# EAGLE schematic radical-pneu (EAGLE 7.2.0)
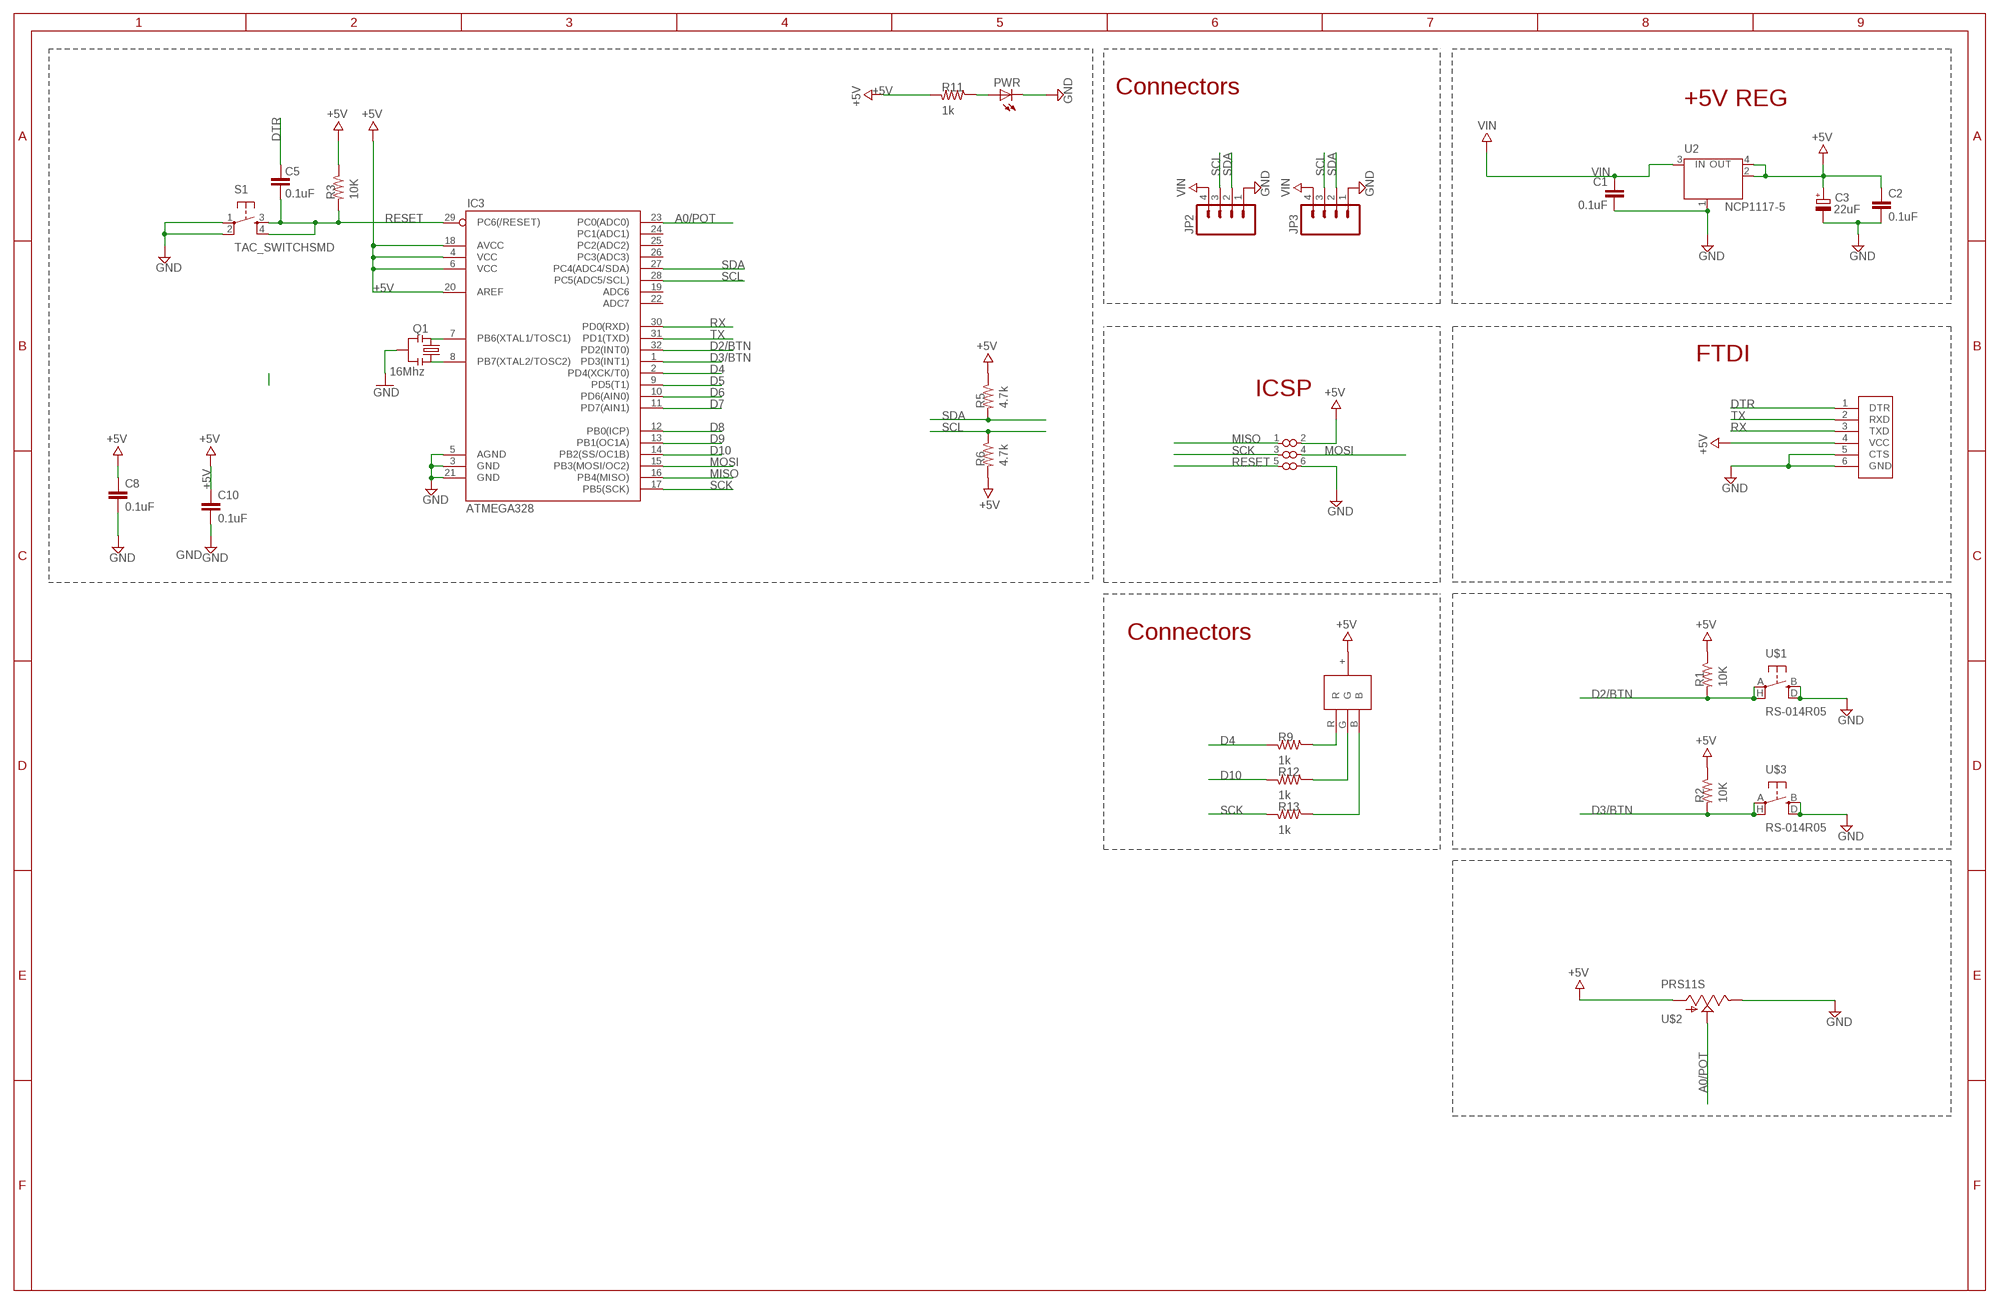
[diagram p0: schematic, sheet 1]

## Parts
C1  0.1uF  CAP0603-CAP  [0603-CAP]
C2  0.1uF  CAP0603-CAP  [0603-CAP]
C3  22uF  CPOL-EUSMCB  [SMC_B]
C5  0.1uF  CAP0805  [0805]
C8  0.1uF  CAP0603-CAP  [0603-CAP]
C10  0.1uF  CAP0603-CAP  [0603-CAP]
IC3  ATMEGA328  ATMEGA168  [TQFP32-08]
JP2  M04PTH  [1X04]
JP3  M04PTH  [1X04]
PWR  LEDCHIPLED_0603  [CHIPLED_0603]
Q1  16Mhz  RESONATORSMD  [RESONATOR-SMD]
R1  10K  RESISTOR0805-RES  [0805]
R2  10K  RESISTOR0805-RES  [0805]
R3  10K  RESISTOR0805-RES  [0805]
R5  4.7k  RESISTOR0805-RES  [0805]
R6  4.7k  RESISTOR0805-RES  [0805]
R9  1k  RESISTOR0805-RES  [0805]
R11  1k  RESISTOR0805-RES  [0805]
R12  1k  RESISTOR0805-RES  [0805]
R13  1k  RESISTOR0805-RES  [0805]
S1  TAC_SWITCHSMD  [TACTILE-SWITCH-SMD]
U2  NCP1117-5  LINEAR_MC33269ST  [LINEAR_SOT223]
U$1  RS-014R05  [SWITCH-11MM]
U$2  PRS11S  [PRS11S]
U$3  RS-014R05  [SWITCH-11MM]
U$10  ISP_POGO  [POGO_ISP]
U$12  FTDI_POGO  [FTDI_POGO]
U$21  LTST-C19FD1WT  [LTST]

## Nets
+5V: C2.1 C3.+ C8.1 C10.1 IC3.4(VCC) IC3.6(VCC) IC3.18(AVCC) IC3.20(AREF) R1.1 R2.1 R3.1 R5.1 R6.2 R11.2 U2.2(OUT) U2.4(OUT) U$2.1(A) U$10.2(VCC) U$12.4(VCC) U$21.+(VCC)
A0/POT: IC3.23(PC0(ADC0)) U$2.2(S)
D2/BTN: IC3.32(PD2(INT0)) R1.2 U$1.A U$1.H
D3/BTN: IC3.1(PD3(INT1)) R2.2 U$3.A U$3.H
D4: IC3.2(PD4(XCK/T0)) R9.2
D5: IC3.9(PD5(T1))
D6: IC3.10(PD6(AIN0))
D7: IC3.11(PD7(AIN1))
D8: IC3.12(PB0(ICP))
D9: IC3.13(PB1(OC1A))
D10: IC3.14(PB2(SS/OC1B)) R12.2
DTR: C5.2 U$12.1(DTR)
GND: C1.2 C2.2 C3.- C8.2 C10.2 IC3.3(GND) IC3.5(AGND) IC3.21(GND) JP2.1 JP3.1 PWR.C Q1.2 S1.1 S1.2 U2.1(GND/ADJ) U$1.B U$1.D U$2.3(E) U$3.B U$3.D U$10.6(GND) U$12.5(CTS) U$12.6(GND)
MISO: IC3.16(PB4(MISO)) U$10.1(MISO)
MOSI: IC3.15(PB3(MOSI/OC2)) U$10.4(MOSI)
N$4: IC3.8(PB7(XTAL2/TOSC2)) Q1.1
N$8: IC3.7(PB6(XTAL1/TOSC1)) Q1.3
N$10: PWR.A R11.1
N$11: R9.1 U$21.R
N$12: R12.1 U$21.G
N$13: R13.1 U$21.B
RESET: C5.1 IC3.29(PC6(/RESET)) R3.2 S1.3 S1.4 U$10.5(RESET)
RX: IC3.30(PD0(RXD)) U$12.3(TXD)
SCK: IC3.17(PB5(SCK)) R13.2 U$10.3(SCK)
SCL: IC3.28(PC5(ADC5/SCL)) JP2.3 JP3.3 R6.1
SDA: IC3.27(PC4(ADC4/SDA)) JP2.2 JP3.2 R5.2
TX: IC3.31(PD1(TXD)) U$12.2(RXD)
VIN: C1.1 JP2.4 JP3.4 U2.3(IN)
Unconnected: IC3.19(ADC6) IC3.22(ADC7) IC3.24(PC1(ADC1)) IC3.25(PC2(ADC2)) IC3.26(PC3(ADC3))

## Notes on the sheet
- Connectors
- +5V REG
- FTDI
- ICSP
- Connectors

## Library data of the parts
C1 C2 C5 C8 C10 = SparkFun-Capacitors:CAP: Capacitor Standard 0603 ceramic capacitor, and 0.1" leaded capacitor.
C3 = rcl:CPOL-EU: POLARIZED CAPACITOR, European symbol
IC3 = SparkFun:ATMEGA168
JP2 JP3 = SparkFun-Connectors:M04: Header 4 Standard 4-pin 0.1" header. Use with straight break away headers (SKU : PRT-00116), right angle break away headers (PRT-00553), swiss pins (PRT-00743), machine pins (PRT-00117), and female headers (PRT-00115). Molex polarized connector foot print use with SKU : PRT-08231 with associated crimp pins and housings. 1MM SMD Version SKU: PRT-10208
PWR = adafruit:LED: LED OSRAM: - CHIPLED LG R971, LG N971, LY N971, LG Q971, LY Q971, LO R971, LY R971 LH N974, LH R974 LS Q976, LO Q976, LY Q976 LO Q996 - Hyper CHIPLED LW Q18S LB Q993, LB Q99A, LB R99A - SideLED LS A670, LO A670, LY A670, LG A670, LP A670 LB A673, LV A673, LT A673, LW A673 LH A674 LY A675 LS A676, LA A676, LO A676, LY A676, LW A676 LS A679, LY A679, LG A679 - Hyper Micro SIDELED® LS Y876, LA Y876, LO Y876, LY Y876 LT Y87S - SmartLED LW L88C, LW L88S LB L89C, LB L89S, LG L890 LS L89K, LO L89K, LY L89K LS L896, LA L896, LO L896, LY L896 - TOPLED LS T670, LO T670, LY T670, LG T670, LP T670 LSG T670, LSP T670, LSY T670, LOP T670, LYG T670 LG T671, LOG T671, LSG T671 LB T673, LV T673, LT T673, LW T673 LH T674 LS T676, LA T676, LO T676, LY T676, LB T676, LH T676, LSB T676, LW T676 LB T67C, LV T67C, LT T67C, LS T67K, LO T67K, LY T67K, LW E67C LS E67B, LA E67B, LO E67B, LY E67B, LB E67C, LV E67C, LT E67C LW T67C LS T679, LY T679, LG T679 LS T770, LO T770, LY T770, LG T770, LP T770 LB T773, LV T773, LT T773, LW T773 LH T774 LS E675, LA E675, LY E675, LS T675 LS T776, LA T776, LO T776, LY T776, LB T776 LHGB T686 LT T68C, LB T68C - Hyper Mini TOPLED® LB M676 - Mini TOPLED Santana® LG M470 LS M47K, LO M47K, LY M47K Source: http://www.osram.convergy.de/
Q1 = SparkFun:RESONATOR: Resonator Small SMD resonator. This is the itty bitty 10/20MHz resonators with built in caps. CSTCE10M0G55 and CSTCE20M0V53. Footprint has been reviewed closely but hasn't been tested yet.
R1-R3 R5 R6 R9 R11-R13 = SparkFun-Resistors:RESISTOR: Resistor Basic schematic elements and footprints for 0603, 1206, and PTH resistors.
S1 = SparkFun-Electromechanical:TAC_SWITCH: Momentary Switch Button commonly used for reset or general input. Spark Fun Electronics SKU : COM-00097 SMT- SWCH-08247; PROD_ID: SWCH-08247
U2 = SmartPrj:LINEAR_MC33269ST*: Adjustable Output Low Dropout Voltage Regulator 800 mA Source: http://www.onsemi.com/pub/Collateral/MC33269-D.PDF
U$1 U$3 = digikey:RS-014R05
U$2 = digikey:PRS11S
U$10 = digikey:ISP_POGO
U$12 = digikey:FTDI_POGO
U$21 = digikey:LTST-C19FD1WT

## Net classes
1 vcc: width 0.254 mm